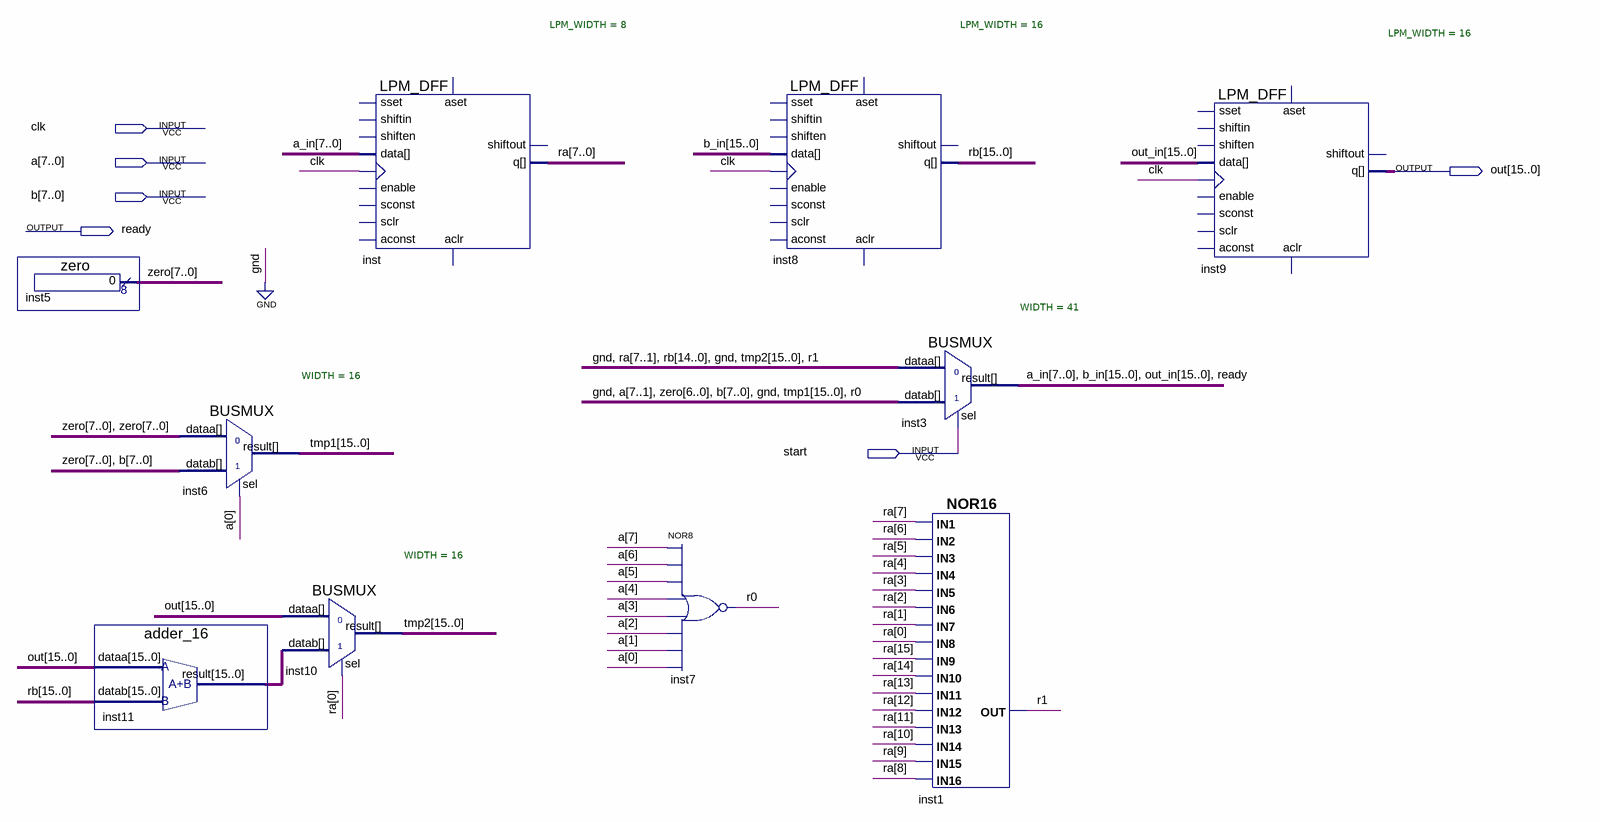
[diagram p0: schematic sheet]
// Quartus schematic unsigned_multiplier.bdf as structural Verilog: 10 symbols, 6 pins
module unsigned_multiplier (
  input  clk,
  input  [7:0] a,
  input  [7:0] b,
  input  start,
  output [15:0] out,
  output ready
);

  wire r0, r1;
  wire [7:0] a_in, zero;
  wire [15:0] b_in, inst11_result, out_in, ra, rb, tmp1, tmp2;

  zero inst5 (.result(zero));
  adder_16 inst11 (.dataa(out), .datab(rb), .result(inst11_result));
  BUSMUX #(.WIDTH(16)) inst6 (.datab({zero, b}), .sel(a[0]), .dataa({zero, zero}), .result(tmp1));
  BUSMUX #(.WIDTH(16)) inst10 (.datab(inst11_result), .sel(ra[0]), .dataa(out), .result(tmp2));
  LPM_DFF #(.LPM_WIDTH(8)) inst (
    .clock(clk), .data(a_in), .q(ra[7:0]));  // open: shiftin, shiften, enable, aconst, sclr, sconst, sset, aset, aclr, shiftout
  nor inst7 (r0, a[7], a[6], a[5], a[4], a[3], a[2], a[1], a[0]);
  LPM_DFF #(.LPM_WIDTH(16)) inst8 (
    .clock(clk), .data(b_in), .q(rb));  // open: shiftin, shiften, enable, aconst, sclr, sconst, sset, aset, aclr, shiftout
  BUSMUX #(.WIDTH(41)) inst3 (
    .datab({1'b0, a[7:1], zero[6:0], b, 1'b0, tmp1, r0}), .sel(start),
    .dataa({1'b0, ra[7:1], rb[14:0], 1'b0, tmp2, r1}), .result({a_in, b_in, out_in, ready}));
  nor inst1 (r1, ra[7], ra[6], ra[5], ra[4], ra[3], ra[2], ra[1], ra[0], ra[15], ra[14], ra[13], ra[12], ra[11], ra[10], ra[9], ra[8]);
  LPM_DFF #(.LPM_WIDTH(16)) inst9 (
    .clock(clk), .data(out_in), .q(out));  // open: shiftin, shiften, enable, aconst, sclr, sconst, sset, aset, aclr, shiftout
endmodule
